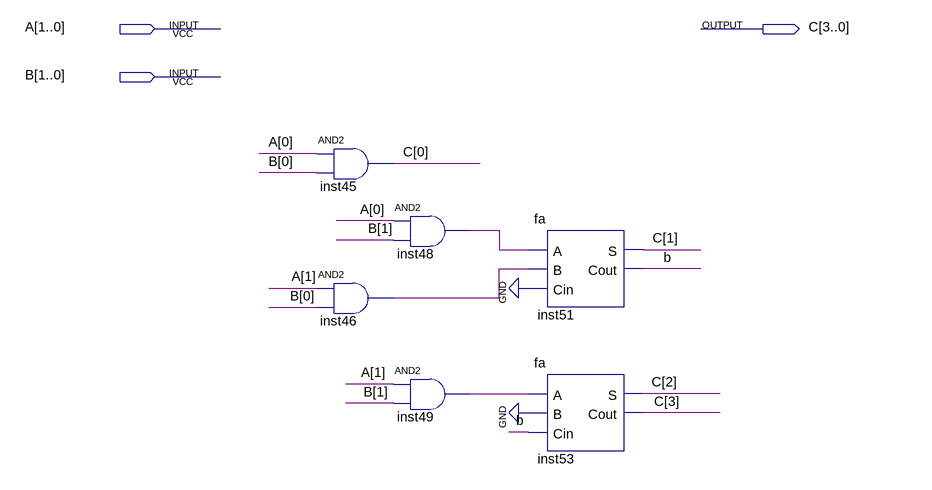
[diagram p0: schematic sheet]
// Quartus schematic mult.bdf as structural Verilog: 6 symbols, 3 pins
module mult (
  input  [1:0] A,
  input  [1:0] B,
  output [3:0] C
);

  wire B_1bit, inst46_out, inst48_out, inst49_out;

  and inst45 (C[0], A[0], B[0]);
  and inst46 (inst46_out, A[1], B[0]);
  and inst48 (inst48_out, A[0], B[1]);
  and inst49 (inst49_out, A[1], B[1]);
  fa inst51 (.A(inst48_out), .B(inst46_out), .Cin(1'b0), .S(C[1]), .Cout(B_1bit));
  fa inst53 (.A(inst49_out), .B(1'b0), .Cin(B_1bit), .S(C[2]), .Cout(C[3]));
endmodule
